# EasyEDA Pro project EasyEDApro.epro, schematic Energy meter
Board Name: Board; Create Date: 2024-08-28; Page Name: P1; Project Name: Robo-EM-ESP32C6-no-uart; Schematic Name: Energy meter; Update Date: 2025-01-08; Company: ROBONOMICS.NETWORK; Drawed: ludovich88; Page Size: A3; Part Number: RNDR-1; Version: RC3
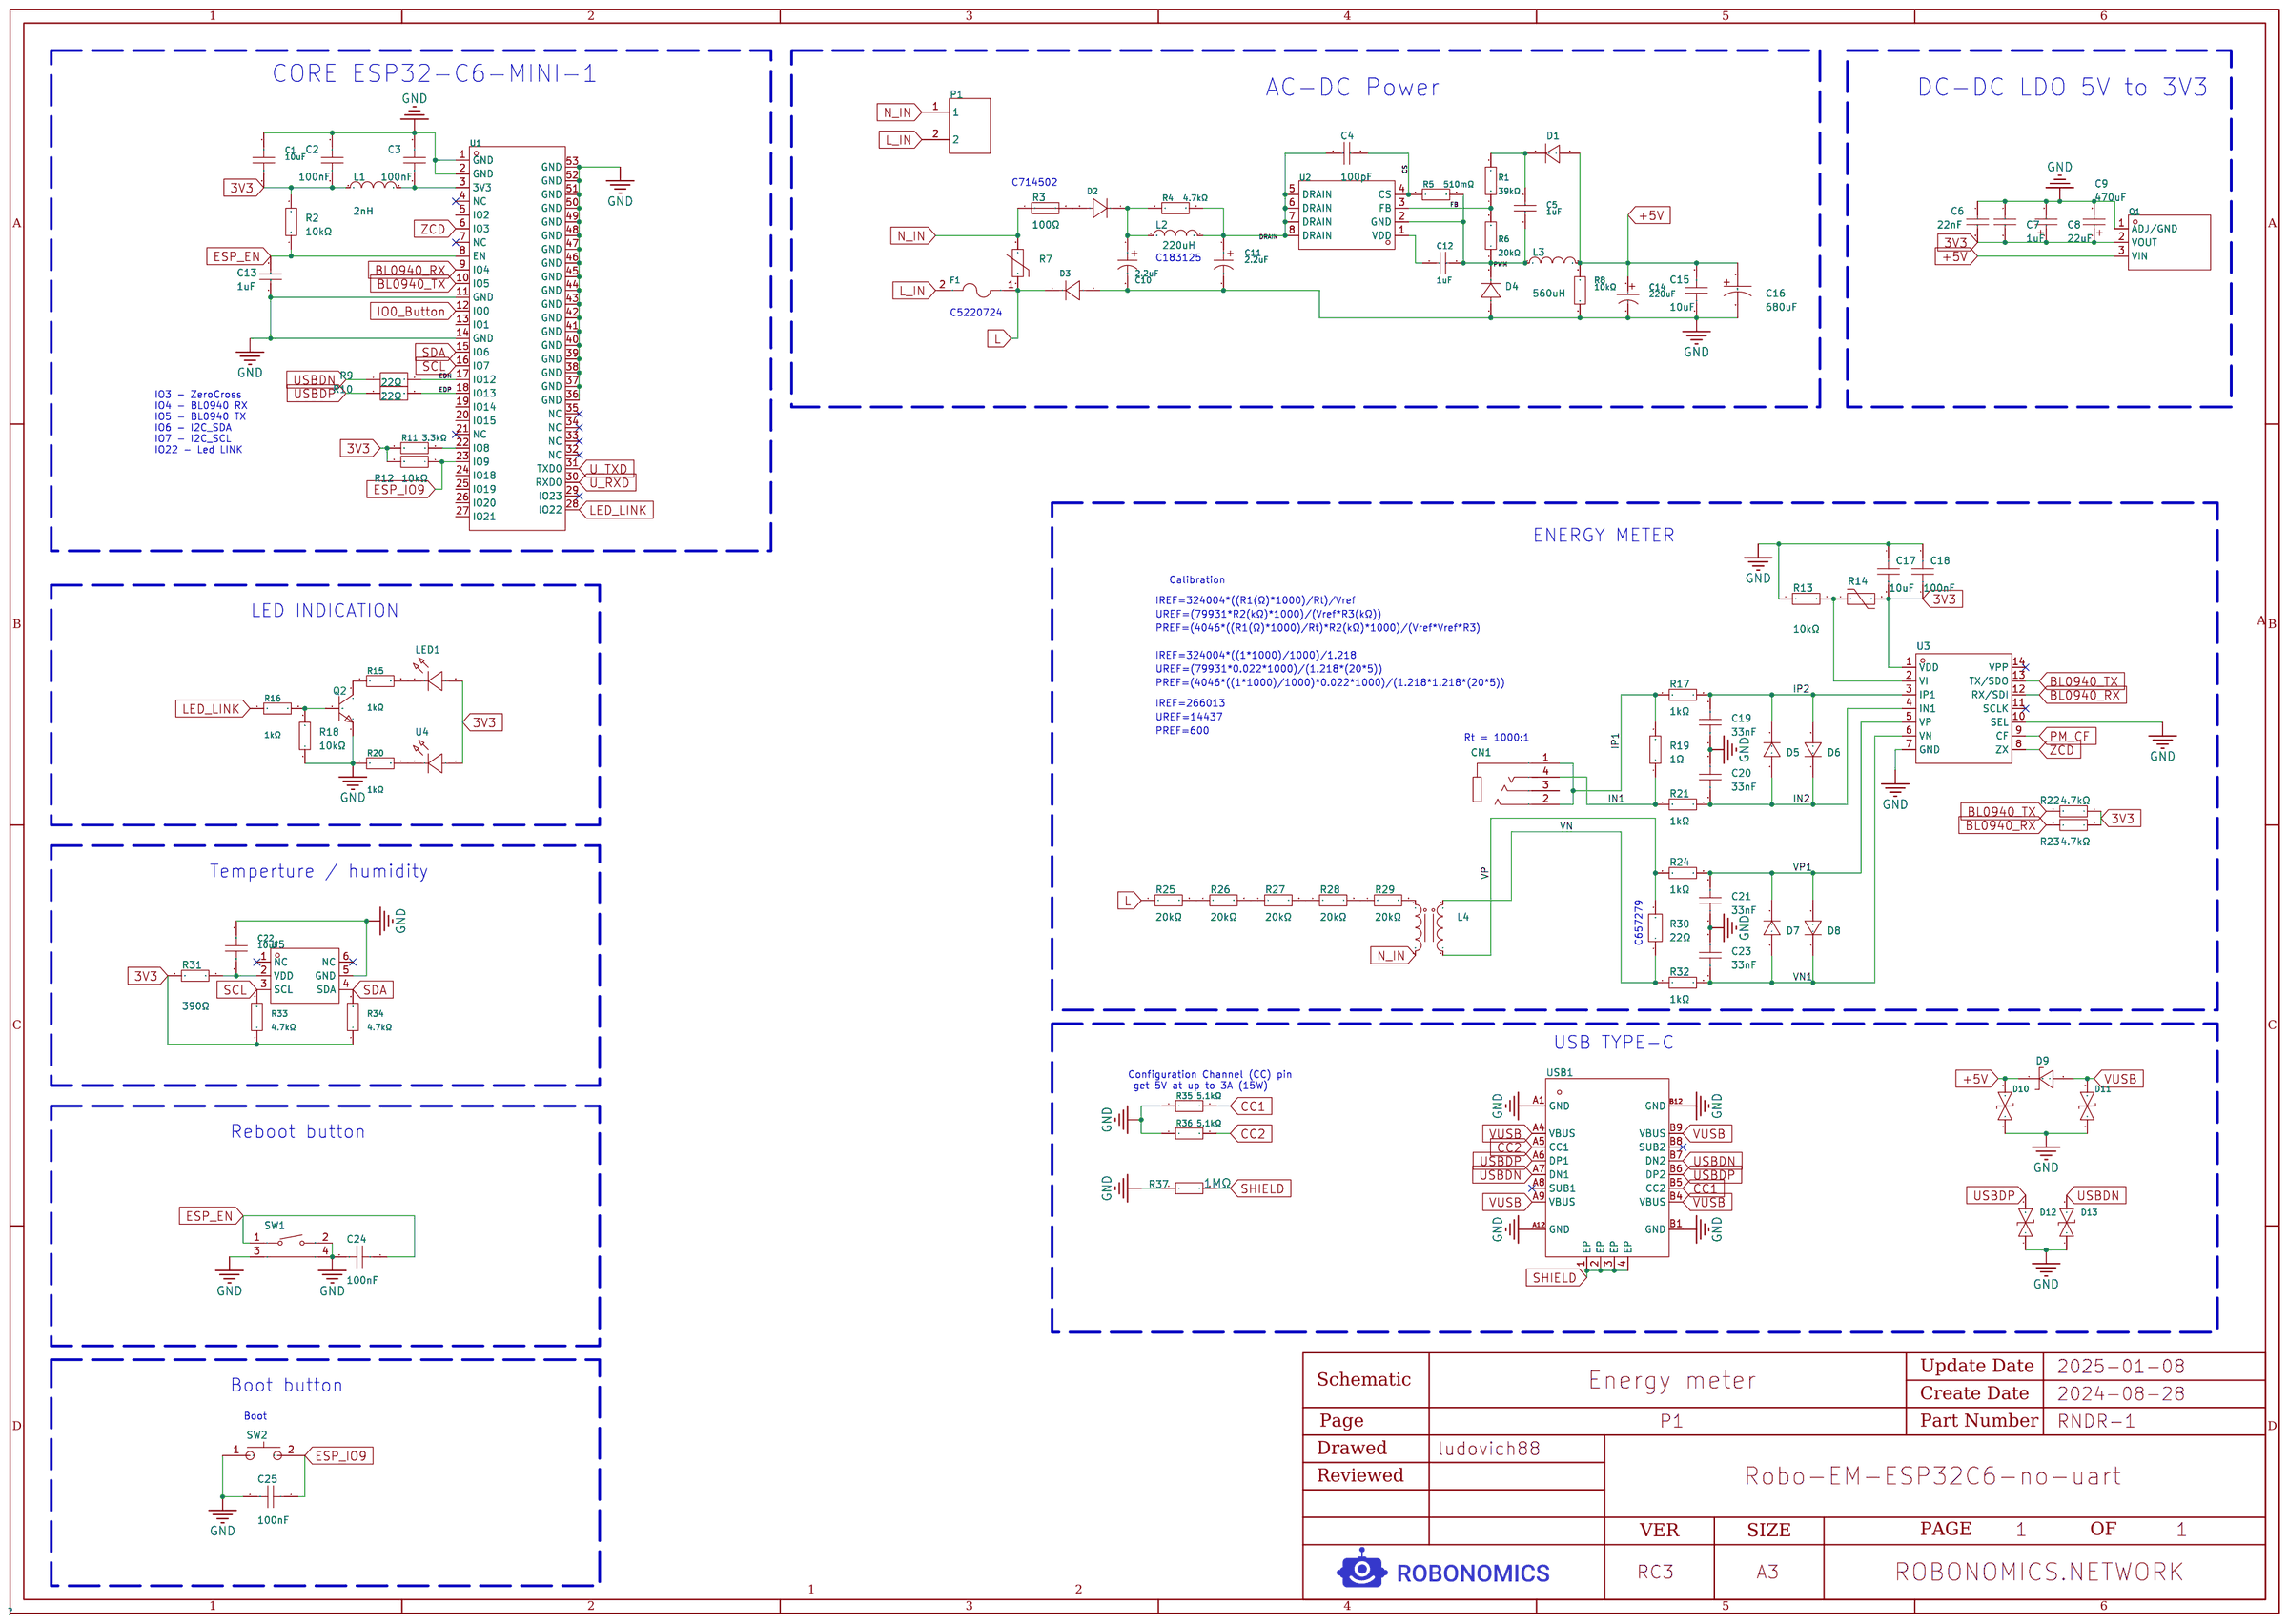
[diagram p0: schematic sheet]

## Parts
C1  10uF  [C0603]
C2  100nF  [C0603]
C3  100nF  [C0603]
C4  100pF  [C1206]
C5  1uF  [C0805]
C6  22nF  [C0603]
C7  1uF  [C0603]
C8  22uF  [CASE-A_3216]
C9  470uF  [CASE-D_7343]  (no BOM)
C10  2.2uF  [CAP-TH_BD6.3-P2.50-D0.5-FD]
C11  2.2uF  [CAP-TH_BD6.3-P2.50-D0.5-FD]
C12  1uF  [C0805]
C13  1uF  [C0603]
C14  220uF  [CAP-TH_BD6.3-P2.50-D1.0-FD]  (no BOM)
C15  10uF  [C0603]
C16  680uF  [CAP-SMD_L7.3-W4.3]
C17  10uF  [C0603]
C18  100nF  [C0603]
C19  33nF  [C0603]
C20  33nF  [C0603]
C21  33nF  [C0603]
C22  10uF  [C0603]
C23  33nF  [C0603]
C24  100nF  [C0603]
C25  100nF  [C0603]
CN1  PJ-320D  [AUDIO-SMD_PJ-320D]
D1  FR107W  [SOD-123F_L2.8-W1.8-LS3.7-RD]
D2  1N4007  [SOD-123FL_L2.8-W1.8-LS3.7-RD]
D3  1N4007  [SOD-123FL_L2.8-W1.8-LS3.7-RD]
D4  E1J  [SOD-123FL_L2.7-W1.8-LS3.7-RD]
D5  1N4148WS  [SOD-323_L1.8-W1.3-LS2.5-RD]
D6  1N4148WS  [SOD-323_L1.8-W1.3-LS2.5-RD]
D7  1N4148WS  [SOD-323_L1.8-W1.3-LS2.5-RD]
D8  1N4148WS  [SOD-323_L1.8-W1.3-LS2.5-RD]
D9  -  [SOD-323_L1.8-W1.3-LS2.5-RD]
D10  LESD5D5.0CT1G-ES  [SOD-523_L1.2-W0.8-LS1.6-BI]
D11  LESD5D5.0CT1G-ES  [SOD-523_L1.2-W0.8-LS1.6-BI]
D12  LESD5D5.0CT1G-ES  [SOD-523_L1.2-W0.8-LS1.6-BI]
D13  LESD5D5.0CT1G-ES  [SOD-523_L1.2-W0.8-LS1.6-BI]
F1  JFC2410-1200FS  [F2410]
L1  2nH  [L0603]
L2  220uH  [IND-TH_BD4.0-P5.00-D0.8]
L3  560uH  [IND-SMD_L10.5-W10.5]
L4  HPT225A-G  [XFMR-TH_4P-L19.0-10.0-P7.20]
LED1  XL-4008UGC  [LED-SMD_L4.0-W1.4-RD_GREEN]
P1  WJ128V-5.0-2P  [CONN-TH_2P-P5.00_WJ128V-5.0-2P]
Q1  AMS1117-3.3V  [SOT-89-3_L4.5-W2.5-P1.50-LS4.2-BR]
Q2  SS8050  [SOT-23-3_L2.9-W1.6-P1.90-LS2.8-BR]
R1  39kΩ  [R0805]
R2  10kΩ  [R0402]
R3  100Ω  [IND-TH_BD4.0-P5.00-D0.8]
R4  4.7kΩ  [R0603]
R5  510mΩ  [R1206]
R6  20kΩ  [R0805]
R7  07D471K68RV0149  [RES-SMD_L8.2-W6.3]
R8  10kΩ  [R0805]
R9  22Ω  [R0402]
R10  22Ω  [R0402]
R11  3.3kΩ  [R0402]
R12  10kΩ  [R0402]
R13  10kΩ  [R0402]
R14  CMFA103J3950HANT  [R0603]
R15  1kΩ  [R0402]
R16  1kΩ  [R0402]
R17  1kΩ  [R0603]
R18  10kΩ  [R0402]
R19  1Ω  [R0603]
R20  1kΩ  [R0402]
R21  1kΩ  [R0603]
R22  4.7kΩ  [R0603]
R23  4.7kΩ  [R0603]
R24  1kΩ  [R0603]
R25  20kΩ  [R0603]
R26  20kΩ  [R0603]
R27  20kΩ  [R0603]
R28  20kΩ  [R0603]
R29  20kΩ  [R0603]
R30  22Ω  [R0603]
R31  390Ω  [R0402]
R32  1kΩ  [R0603]
R33  4.7kΩ  [R0402]
R34  4.7kΩ  [R0402]
R35  5.1kΩ  [R0402]
R36  5.1kΩ  [R0402]
R37  1MΩ  [R0603]
SW1  TS-1010-C-A  [KEY-SMD_TX-1010-X-X]
SW2  -  [SW-SMD_L3.9-W2.9-P4.15-LS5.0]
U1  ESP32-C6-MINI-1-N4  [WIFIM-SMD_61P-L16.6-W13.2-P0.80-ESP32-C6-MINI-1-N4]
U2  KP15051SPA  [SOP-8_L4.9-W3.8-P1.27-LS6.0-BL]
U3  BL0940  [TSSOP-14_L5.0-W4.4-P0.65-LS6.4-BL]
U4  XL-4008SURC  [LED-SMD_L4.0-W1.4-FD_C9900036310]
U5  AHT20  [SENSOR-SMD_L3.0-W3.0-P1.00-BR]
USB1  KH-TYPE-C-16P  [USB-C-SMD_KH-TYPE-C-16P]

## Library data of the parts
C1 C22 = GRM188R61E106KA73D: Capacitance: Tolerance:±10% Tolerance:±10% Voltage Rated: Temperature Coefficient:; LCSC Part Name: 10uF ±10% 25V; Supplier Part: C344022; Manufacturer: muRata(村田); Supplier Footprint: 0603; JLCPCB Part Class: Extended Part; Datasheet: https://atta.szlcsc.com/upload/public/pdf/source/20181211/C344022_BB98D43E7DA95E5A749FBFE073C8A3E0.pdf; Supplier: LCSC; Tolerance: ±10%
C2 C3 = CC0603KRX7R9BB104: Capacitance: Tolerance:±10% Tolerance:±10% Voltage Rated: Temperature Coefficient:; LCSC Part Name: 100nF ±10% 50V; Supplier Part: C14663; Manufacturer: YAGEO(国巨); Supplier Footprint: 0603; JLCPCB Part Class: Basic Part; Datasheet: https://atta.szlcsc.com/upload/public/pdf/source/20180910/C282072_33301C7F631E79921B82A8DAC6BCC5B3.pdf; Supplier: LCSC; Tolerance: ±10%; Voltage Rated: 50V; Temperature Coefficient: Y5V
C4 = 1206CG101J102NT_C9188: Capacitance: Tolerance:±5% Tolerance:±5% Voltage Rated: Temperature Coefficient:; LCSC Part Name: 100pF ±5% 1kV; Supplier Part: C9188; Manufacturer: FH(风华); Manufacturer Part: 1206CG101J102NT; Supplier Footprint: 1206; JLCPCB Part Class: Extended Part; Datasheet: https://atta.szlcsc.com/upload/public/pdf/source/20200305/C486355_26A10D38EF8C2A5C37091D0039909270.pdf; Supplier: LCSC; Tolerance: ±5%
C5 C12 = CL21B105KBFNNNE: Capacitance: Tolerance:±10% Tolerance:±10% Voltage Rated: Temperature Coefficient:; LCSC Part Name: 1uF ±10% 50V; Supplier Part: C28323; Manufacturer: SAMSUNG(三星); Supplier Footprint: 0805; JLCPCB Part Class: Basic Part; Datasheet: https://atta.szlcsc.com/upload/public/pdf/source/20160218/1457707763339.pdf; Supplier: LCSC; Tolerance: ±10%
C6 = CL10B223KB8NNNC: Capacitance:22nF Tolerance:±10% Tolerance:±10% Voltage Rated:50V Temperature Coefficient:X7R; LCSC Part Name: 22nF±10%50V; Supplier Part: C21122; Manufacturer: SAMSUNG(三星); Supplier Footprint: 0603; JLCPCB Part Class: BasicPart; Datasheet: https://atta.szlcsc.com/upload/public/pdf/source/20160103/1457707705232.pdf; Supplier: LCSC; Tolerance: ±10%; Voltage Rated: 50V; Temperature Coefficient: X7R
C7 = CL10A105KB8NNNC: Capacitance:1uF Tolerance:±10% Tolerance:±10% Voltage Rated:50V Temperature Coefficient:X5R; LCSC Part Name: 1uF±10%50V; Supplier Part: C15849; Manufacturer: SAMSUNG(三星); Supplier Footprint: 0603; JLCPCB Part Class: BasicPart; Datasheet: https://atta.szlcsc.com/upload/public/pdf/source/20160103/1457707679084.pdf; Supplier: LCSC; Tolerance: ±10%; Voltage Rated: 50V; Temperature Coefficient: X5R
C8 = TAJA226K010RNJ: Capacitance: Tolerance:±10% Tolerance:±10% Rated Voltage: Equivalent Series Resistance(ESR):3Ω@100kHz Operating Temperature:-55℃~+125℃ Operating Temperature:-55℃~+125℃; LCSC Part Name: 22uF ±10% 10V; Supplier Part: C11366; Manufacturer: Kyocera AVX; JLCPCB Part Class: Extended Part; Datasheet: https://atta.szlcsc.com/upload/public/pdf/source/20160107/1457707744993.pdf; Supplier: LCSC; Tolerance: ±10%; Equivalent Series Resistance(ESR): 3Ω@100kHz; Operating Temperature: -55℃~+125℃
C9 = 6TPE470MAZU: Capacitance: Tolerance:±20% Tolerance:±20% Rated Voltage: Equivalent Series Resistance(ESR):35mΩ@100kHz Operating Temperature:-55℃~+105℃ Operating Temperature:-55℃~+105℃; LCSC Part Name: 470uF ±20% 6.3V; Supplier Part: C79114; Manufacturer: PANASONIC(松下); JLCPCB Part Class: Extended Part; Datasheet: https://atta.szlcsc.com/upload/public/pdf/source/20180301/C178383_15198943937361383951.pdf; Supplier: LCSC; Tolerance: ±20%; Equivalent Series Resistance(ESR): 35mΩ@100kHz; Operating Temperature: -55℃~+105℃
C10 C11 = ECH2GM2R2E09OTZO: Capacitance: Tolerance:±20% Tolerance:±20% Rated Voltage: Ripple Current:- Equivalent Series Resistance(ESR):- Lead Spacing:2.5mm φD:- L:- Lifetime @ Temp:-; LCSC Part Name: 2.2uF ±20% 400V; Supplier Part: C784523; Manufacturer: Yunxing(云星); Supplier Footprint: 插件,D6.3xL9mm; JLCPCB Part Class: Extended Part; Datasheet: https://atta.szlcsc.com/upload/public/pdf/source/20200914/C784406_C58084797B874E7C9A84BE67146A332E.pdf; Supplier: LCSC; Tolerance: ±20%; Lead Spacing: 2.5mm
C13 = CL10A105KO8NNNC: Capacitance: Tolerance:±10% Tolerance:±10% Voltage Rated: Temperature Coefficient:; LCSC Part Name: 1uF ±10% 16V; Supplier Part: C1592; Manufacturer: SAMSUNG(三星); Supplier Footprint: 0603; JLCPCB Part Class: Extended Part; Datasheet: https://atta.szlcsc.com/upload/public/pdf/source/20220919/9FBE606BE0D9532D730F292EB26DC5BB.pdf; Supplier: LCSC; Tolerance: ±10%
C14 = 16YXJ220M6.3X11: Capacitance: Tolerance:±20% Tolerance:±20% Rated Voltage: Ripple Current:400mA@100kHz Equivalent Series Resistance(ESR):220mΩ@100kHz Lead Spacing: φD: L: Lifetime @ Temp:7000hrs@105℃; LCSC Part Name: 220uF ±20% 16V; Supplier Part: C88757; Manufacturer: rubycon(红宝石); Supplier Footprint: 插件,D6.3xL11mm; JLCPCB Part Class: Extended Part; Datasheet: https://atta.szlcsc.com/upload/public/pdf/source/20190927/C432444_D90212164DBC1B856ABE912664018FD4.pdf; Supplier: LCSC; Tolerance: ±20%; Ripple Current: 400mA@100kHz; Equivalent Series Resistance(ESR): 220mΩ@100kHz; Lifetime @ Temp: 7000hrs@105℃
C15 = CL10A106KP8NNNC: Capacitance: Tolerance:±10% Tolerance:±10% Voltage Rated: Temperature Coefficient:; LCSC Part Name: 10uF ±10% 10V; Supplier Part: C19702; Manufacturer: SAMSUNG(三星); Supplier Footprint: 0603; JLCPCB Part Class: Basic Part; Datasheet: https://atta.szlcsc.com/upload/public/pdf/source/20160218/1457707763339.pdf; Supplier: LCSC; Tolerance: ±10%; Voltage Rated: 10V; Temperature Coefficient: X5R
C16 = TAJE687K006RNJ: Capacitance: Tolerance:±10% Tolerance:±10% Rated Voltage: Equivalent Series Resistance(ESR):500mΩ@100kHz Operating Temperature:-55℃~+125℃ Operating Temperature:-55℃~+125℃; LCSC Part Name: 680uF±10%6.3V; Supplier Part: C308811; Manufacturer: KyoceraAVX; Supplier Footprint: CASE-E-7343; JLCPCB Part Class: ExtendedPart; Datasheet: https://atta.szlcsc.com/upload/public/pdf/source/20181031/C308811_5A7B8BD02B1566F52935A1016FD2A024.pdf; Supplier: LCSC; Tolerance: ±10%; Equivalent Series Resistance(ESR): 500mΩ@100kHz; Operating Temperature: -55℃~+125℃
C17 = CL10A106MQ8NNNC: Capacitance: Tolerance:±20% Tolerance:±20% Voltage Rated: Temperature Coefficient:; LCSC Part Name: 10uF±20%6.3V; Supplier Part: C1691; Manufacturer: SAMSUNG(三星); Supplier Footprint: 0603; JLCPCB Part Class: ExtendedPart; Datasheet: https://atta.szlcsc.com/upload/public/pdf/source/20160103/1457707690948.pdf; Supplier: LCSC; Tolerance: ±20%
C18 C24 = 0603ZC104KAT2A: Capacitance: Tolerance:±10% Tolerance:±10% Voltage Rated: Temperature Coefficient:; LCSC Part Name: 100nF±10%10V; Supplier Part: C597251; Manufacturer: KyoceraAVX; Supplier Footprint: 0603; Datasheet: https://atta.szlcsc.com/upload/public/pdf/source/20200611/C596996_5C2870FCBE04273D0B42880C13DA8C38.pdf; Supplier: LCSC; Tolerance: ±10%
C19-C21 C23 = CC0603JRX7R9BB333: Capacitance: Tolerance:±5% Tolerance:±5% Voltage Rated: Temperature Coefficient:; LCSC Part Name: 33nF±5%50V; Supplier Part: C327162; Manufacturer: YAGEO(国巨); Supplier Footprint: 0603; JLCPCB Part Class: ExtendedPart; Datasheet: https://atta.szlcsc.com/upload/public/pdf/source/20181031/C327162_E0FA0E4D62FC939BEC1D516A6479F390.pdf; Supplier: LCSC; Tolerance: ±5%
C25 = CC0603KRX7R9BB104: Capacitance: Tolerance:±10% Tolerance:±10% Voltage Rated: Temperature Coefficient:; LCSC Part Name: 100nF ±10% 50V; Supplier Part: C14663; Manufacturer: YAGEO(国巨); Supplier Footprint: 0603; JLCPCB Part Class: Basic Part; Datasheet: https://atta.szlcsc.com/upload/public/pdf/source/20180910/C282072_33301C7F631E79921B82A8DAC6BCC5B3.pdf; Supplier: LCSC; Tolerance: ±10%
CN1 = PJ-320D_C431535: Connector Type:3.5mm耳机座 Current Rating (Max):300mA Voltage Rating (Max):50V Operating Temperature Range:-16℃~+65℃ Operating Temperature Range:-16℃~+65℃; LCSC Part Name: 3.5mm耳机座; Supplier Part: C431535; Manufacturer: SHOU HAN(首韩); Supplier Footprint: SMD; JLCPCB Part Class: Extended Part; Datasheet: https://atta.szlcsc.com/upload/public/pdf/source/20190925/C431535_8B274506621F6117FB020BF07A197848.pdf; Supplier: LCSC; Connector Type: 3.5mm耳机座; Current Rating (Max): 300mA; Voltage Rating (Max): 50V; Operating Temperature Range: -16℃~+65℃
D1 = FR107W_C122857: Diode Configuration: Forward Voltage (Vf@If):1.3V@1A Reverse Voltage (Vr): Average Rectified Current (Io): Reverse Leakage Current:5uA@1kV Reverse Recovery Time (trr): Operating Temperature:-55℃~+150℃@(Tj) Operating Temperature:-55℃~+150℃@(Tj); LCSC Part Name: 电压:1kV 电流:1A; Supplier Part: C122857; Manufacturer: SHIKUES(时科); Supplier Footprint: SOD-123F; JLCPCB Part Class: Extended Part; Datasheet: https://atta.szlcsc.com/upload/public/pdf/source/20180316/F3E7108A5E6E8028984F3C9596186C34.pdf; Supplier: LCSC; Forward Voltage (Vf@If): 1.3V@1A; Reverse Leakage Current: 5uA@1kV; Operating Temperature: -55℃~+150℃@(Tj)
D2 D3 = 1N4007_C2892681: Diode Configuration: Forward Voltage (Vf@If):1.1V@1A Reverse Voltage (Vr): Average Rectified Current (Io):900mA Reverse Leakage Current:10uA@1kV; LCSC Part Name: 电压:1kV 电流:900mA; Supplier Part: C2892681; Manufacturer: YONGYUTAI(永裕泰); Supplier Footprint: SOD-123FL; JLCPCB Part Class: Extended Part; Datasheet: https://atta.szlcsc.com/upload/public/pdf/source/20210906/CD4B8BA5932635E7169B31B2BD14088A.pdf; Supplier: LCSC; Forward Voltage (Vf@If): 1.1V@1A; Average Rectified Current (Io): 900mA; Reverse Leakage Current: 10uA@1kV
D4 = E1J_C2940141: Diode Configuration: Forward Voltage (Vf@If):1.7V@1A Reverse Voltage (Vr): Average Rectified Current (Io): Reverse Leakage Current:5uA@600V Reverse Recovery Time (trr): Operating Temperature:-55℃~+150℃@(Tj) Operating Temperature:-55℃~+150℃@(Tj); LCSC Part Name: 电压:600V 电流:1A; Supplier Part: C2940141; Manufacturer: LGE(鲁光); Supplier Footprint: SOD-123FL; JLCPCB Part Class: Extended Part; Datasheet: https://atta.szlcsc.com/upload/public/pdf/source/20211231/1226450B3FE7439E66FFBC955F653A9D.pdf; Supplier: LCSC; Forward Voltage (Vf@If): 1.7V@1A; Reverse Leakage Current: 5uA@600V; Operating Temperature: -55℃~+150℃@(Tj)
D5-D8 = 1N4148WS_C2128: Diode Configuration: Power Dissipation: Reverse Voltage (Vr): Average Rectified Current (Io): Forward Voltage (Vf@If):1.25V@150mA Reverse Leakage Current:1uA@75V Reverse Recovery Time (trr): Operating Temperature:+150℃@(Tj) Operating Temperature:+150℃@(Tj; LCSC Part Name: 100V150mA4nsT4; Supplier Part: C2128; Manufacturer: CJ(江苏长电/长晶); Supplier Footprint: SOD-323; JLCPCB Part Class: BasicPart; Datasheet: https://atta.szlcsc.com/upload/public/pdf/source/20140809/1457707208178.pdf; Supplier: LCSC; Forward Voltage (Vf@If): 1.25V@150mA; Reverse Leakage Current: 1uA@75V; Operating Temperature: +150℃@(Tj)
D9 = 1N5819WS: Reverse Voltage (Vr):40V Average Rectified Current (Io):1A Forward Voltage (Vf@If):600mV@1A; LCSC Part Name: 40V1A600mV@1A; Supplier Part: C191023; Manufacturer: Hottech(合科泰); Supplier Footprint: SOD-323; JLCPCB Part Class: BasicPart; Datasheet: https://atta.szlcsc.com/upload/public/pdf/source/20180614/C191023_3C6A6398B911F3A4C23E7538EE054643.pdf; Supplier: LCSC; Reverse Voltage (Vr): 40V; Average Rectified Current (Io): 1A; Forward Voltage (Vf@If): 600mV@1A
D10-D13 = LESD5D5.0CT1G-ES: polarity:Bidirectional Reverse Stand-Off Voltage (Vrwm):5V Maximum Clamping Voltage:10V Peak Pulse Current (Ipp):8A Peak Pulse Power Dissipation (Ppp):80W Breakdown Voltage:5.8V Reverse Leakage Current (Ir):1uA Number of Lines:Single channel Operating Tem; LCSC Part Name: 普容5.0V，单路双向ESD静电防护器件，30kV，CJ：12pF；音频/视频/通讯防护; Supplier Part: C5199159; Manufacturer: ElecSuper(静芯微); Supplier Footprint: SOD523; JLCPCB Part Class: Extended Part; Datasheet: https://atta.szlcsc.com/upload/public/pdf/source/20240905/10776531C4DE5F6ADA679023752259EC.pdf; Supplier: LCSC; polarity: Bidirectional; Reverse Stand-Off Voltage (Vrwm): 5V; Maximum Clamping Voltage: 10V; Peak Pulse Current (Ipp): 8A; Peak Pulse Power Dissipation (Ppp): 80W; Breakdown Voltage: 5.8V; Reverse Leakage Current (Ir): 1uA; Number of Lines: Single channel; Type: ESD
F1 = JFC2410-1200FS: Type:SMD Fuse Current Rating:2A Voltage Rating  (AC):250V Breaking Capacity:50A Operating Temperature:-55℃~+125℃ Operating Temperature:-55℃~+125℃; LCSC Part Name: 250V贴片式保险丝; Supplier Part: C136365; Manufacturer: JDTfuse(集电通); Supplier Footprint: SMD; JLCPCB Part Class: Extended Part; Datasheet: https://atta.szlcsc.com/upload/public/pdf/source/20230515/4DD82964BD259009D7CA201DAB95185E.pdf; Supplier: LCSC; Type: SMD Fuse; Current Rating: 2A; Voltage Rating  (AC): 250V; Breaking Capacity: 50A; Operating Temperature: -55℃~+125℃
L1 = SDCL1608C2N0STDF_C370234: Inductance: Rated Current:- Saturation Current (Isat):- DC Resistance (DCR):- Q @ Freq:- Frequency - Self Resonant:- Ratings:; Supplier Part: C370234; Manufacturer: Sunlord(顺络); Manufacturer Part: SDCL1608C2N0STDF; Supplier Footprint: 0603; JLCPCB Part Class: Extended Part; Datasheet: https://atta.szlcsc.com/upload/public/pdf/source/20231027/6126A3AAC5912C34388756BE22DEE00C.pdf; Supplier: LCSC
L2 = LGA0410-221KP13E: Inductance: Tolerance:±10% Tolerance:±10% Rated Current:155mA Current - Saturation (Isat):- DC Resistance:5.1Ω Type:Color Circle Coils Inductor Q @ Frequency:55@0.796MHz Frequency - Self Resonant:3MHz Ratings:-; LCSC Part Name: 220uH ±10% 色环电感; Supplier Part: C5158890; Manufacturer: FH(风华); Supplier Footprint: 插件,D4xL10.5mm; Datasheet: https://atta.szlcsc.com/upload/public/pdf/source/20230223/1045017E562DFC965C7BA3020EAE4653.pdf; Supplier: LCSC; Tolerance: ±10%; Rated Current: 155mA; DC Resistance: 5.1Ω; Type: Color Circle Coils Inductor; Q @ Frequency: 55@0.796MHz; Frequency - Self Resonant: 3MHz
L3 = SCDS105R-561M-N: Inductance: Tolerance:±20% Tolerance:±20% Rated Current: DC Resistance (DCR): Type:屏蔽电感; LCSC Part Name: 560uH ±20%; Supplier Part: C329732; Manufacturer: chilisin(奇力新); Supplier Footprint: SMD,10.5x10.3mm; JLCPCB Part Class: Extended Part; Datasheet: https://atta.szlcsc.com/upload/public/pdf/source/20190103/C329740_2B9067CB6874BEF2823D8CF3C9943344.pdf; Supplier: LCSC; Tolerance: ±20%; Type: 屏蔽电感
L4 = HPT225A-G: Current Ratio:1:1 Current Rating:2mA Frequency Range:0.02kHz~10kHz Secondary Side Inductance:- DCR Primary Side (Max):115Ω DCR Secondary Side (Max):115Ω High Potential:4000V@AC; Supplier Part: C254112; Manufacturer: HOP(北京霍远); Supplier Footprint: 插件; JLCPCB Part Class: ExtendedPart; Datasheet: https://atta.szlcsc.com/upload/public/pdf/source/20201208/C254112_A7B3C0B9ED08E71DD9E60AC055CA5EE3.pdf; Supplier: LCSC; Current Ratio: 1:1; Current Rating: 2mA; Frequency Range: 0.02kHz~10kHz; DCR Primary Side (Max): 115Ω; DCR Secondary Side (Max): 115Ω; High Potential: 4000V@AC
LED1 = XL-4008UGC: Emitted Color:Emerald Lens Color:Colorless transparence Dominant Wavelength:520nm~525nm Dominant Wavelength:520nm~525nm Peak Wavelength:525nm Forward Current:50mA Power Dissipation:125mW Viewing Angle:120° Mounting Sytle:Side stickers Operating Temperatur; LCSC Part Name: 侧贴; Supplier Part: C2843772; Manufacturer: XINGLIGHT(成兴光); Supplier Footprint: SMD,1.4x4mm; JLCPCB Part Class: ExtendedPart; Datasheet: https://atta.szlcsc.com/upload/public/pdf/source/20221102/5120FC94C7C2123DB0544AD5FB85956A.pdf; Supplier: LCSC; Emitted Color: Emerald; Lens Color: Colorlesstransparence; Dominant Wavelength: 520nm~525nm; Peak Wavelength: 525nm; Forward Current: 50mA; Power Dissipation: 125mW; Viewing Angle: 120°; Mounting Sytle: Sidestickers; Operating Temperature: -30℃~+85℃
P1 = WJ128V-5.0-2P: Pitch:5mm Structure:1x2P Number of Rows:1 Number of PINs Per Row:2 Mounting Style:直针 Current Rating (Max):20A Voltage Rating (Max):250V Wire Gauge - AWG:12~22 Wire Gauge - AWG:12~22 Wire Gauge - mm2:2.5 Wire Gauge - mm2:2.5 Operating Temperature Range:-40; LCSC Part Name: 5mm1x2P排数:1每排P数:2直针可拼接; Supplier Part: C8269; Manufacturer: KANGNEX(康奈克斯电气); Supplier Footprint: 插件,P=5mm; JLCPCB Part Class: ExtendedPart; Datasheet: https://atta.szlcsc.com/upload/public/pdf/source/20191225/C8269_1FF44D6D2E83DB14A7CA266A410FD9AD.pdf; Supplier: LCSC; Pitch: 5mm; Structure: 1x2P; Number of Rows: 1; Number of PINs Per Row: 2; Mounting Style: 直针; Current Rating (Max): 20A; Voltage Rating (Max): 250V; Wire Gauge - AWG: 12~22; Wire Gauge - mm2: 2.5; Operating Temperature Range: -40℃~+105℃; Color: Green
Q1 = AMS1117-3.3V_C5120796: Output Type: Maximum Input Voltage:18V Output Voltage:3.3V Output Voltage:3.3V MAX Output Current:1A Dropout Voltage:1.4V@(1A) standby current:12mA Operating Temperature:0℃~+125℃ Operating Temperature:0℃~+125℃ Output Polarity:Positive electrode Number of; LCSC Part Name: 输入18V 输出3.3V 1A; Supplier Part: C5120796; Manufacturer: MSKSEMI(美森科); Supplier Footprint: SOT-89; JLCPCB Part Class: Extended Part; Datasheet: https://atta.szlcsc.com/upload/public/pdf/source/20231123/6117526697EB8BF6175FDEEBA0877266.pdf; Supplier: LCSC; Maximum Input Voltage: 18V; Output Voltage: 3.3V; MAX Output Current: 1A; Dropout Voltage: 1.4V@(1A); standby current: 12mA; Operating Temperature: 0℃~+125℃; Output Polarity: Positive electrode; Number of Outputs: 1
Q2 = SS8050_C181160: Transistor Type: Collector-Emitter Breakdown Voltage (Vceo): Collector Current (Ic): Power Dissipation (Pd): Collector Cut-Off Current (Icbo):100nA Collector-Emitter Saturation Voltage (VCE(sat)@Ic,Ib):500mV@800mA,80mA DC Current Gain (hFE@Ic,Vce):200@100; LCSC Part Name: NPN25V1.5AH档（200-350）; Supplier Part: C181160; Manufacturer: Hottech(合科泰); Supplier Footprint: SOT-23; JLCPCB Part Class: ExtendedPart; Datasheet: https://atta.szlcsc.com/upload/public/pdf/source/20220506/87BBA77FEE9CB4B19031AE933C67329E.pdf; Supplier: LCSC; Collector Cut-Off Current (Icbo): 100nA; Collector-Emitter Saturation Voltage (VCE(sat)@Ic,Ib): 500mV@800mA,80mA; DC Current Gain (hFE@Ic,Vce): 200@100mA,1V; Transition Frequency (fT): 100MHz; Operating Temperature: +150℃@(Tj)
R1 = 0805W8J0393T5E: Type:Thick Film Resistors Resistance:39kΩ Tolerance:±5% Tolerance:±5% Power(Watts): Overload Voltage (Max): Temperature Coefficient:±100ppm/℃ Temperature Coefficient:±100ppm/℃ Operating Temperature Range:-55℃~+155℃ Operating Temperature Range:-55℃~+155℃; LCSC Part Name: 39kΩ ±5% 125mW 厚膜电阻; Supplier Part: C25632; Manufacturer: UNI-ROYAL(厚声); Supplier Footprint: 0805; JLCPCB Part Class: Extended Part; Datasheet: https://atta.szlcsc.com/upload/public/pdf/source/20200306/C422600_1E6D84923E4A46A82E41ADD87F860B5C.pdf; Supplier: LCSC; Type: Thick Film Resistors; Tolerance: ±5%; Temperature Coefficient: ±100ppm/℃; Operating Temperature Range: -55℃~+155℃
R2 R12 R13 R18 = RC0402FR-0710KL: Type:Thick Film Resistors Resistance: Tolerance:±1% Tolerance:±1% Power(Watts): Overload Voltage (Max): Temperature Coefficient:±100ppm/℃ Temperature Coefficient:±100ppm/℃ Operating Temperature Range:-55℃~+155℃ Operating Temperature Range:-55℃~+155℃; LCSC Part Name: 厚膜电阻 10kΩ ±1% 62.5mW; Supplier Part: C60490; Manufacturer: YAGEO(国巨); Supplier Footprint: 0402; JLCPCB Part Class: Extended Part; Datasheet: https://atta.szlcsc.com/upload/public/pdf/source/20170925/C131467_1506321478108990263.pdf; Supplier: LCSC; Type: Thick Film Resistors; Tolerance: ±1%; Temperature Coefficient: ±100ppm/℃; Operating Temperature Range: -55℃~+155℃
R3 = RFS01J1000A520NH: Type:Safety Resistor Resistance: Tolerance:±5% Tolerance:±5% Overload Voltage (Max):350V Power(Watts):1W Temperature Coefficient:±350ppm/℃ Temperature Coefficient:±350ppm/℃; LCSC Part Name: 保险电阻 100Ω ±5% 1W; Supplier Part: C274980; Manufacturer: 双羽; Supplier Footprint: 插件; JLCPCB Part Class: Extended Part; Datasheet: https://atta.szlcsc.com/upload/public/pdf/source/20181008/C275112_61B57CF4FECD9E771366D1DDFC695024.pdf; Supplier: LCSC; Type: Safety Resistor; Tolerance: ±5%; Overload Voltage (Max): 350V; Power(Watts): 1W; Temperature Coefficient: ±350ppm/℃
R4 R22 R23 = 0603WAF4701T5E: Type:Thick Film Resistors Resistance:4.7kΩ Tolerance:±1% Tolerance:±1% Power(Watts): Overload Voltage (Max): Temperature Coefficient:±100ppm/℃ Temperature Coefficient:±100ppm/℃ Operating Temperature Range:-55℃~+155℃ Operating Temperature Range:-55℃~+155℃; LCSC Part Name: 4.7kΩ ±1% 100mW 厚膜电阻; Supplier Part: C23162; Manufacturer: UNI-ROYAL(厚声); Supplier Footprint: 0603; JLCPCB Part Class: Basic Part; Datasheet: https://atta.szlcsc.com/upload/public/pdf/source/20200306/C422600_1E6D84923E4A46A82E41ADD87F860B5C.pdf; Supplier: LCSC; Type: Thick Film Resistors; Tolerance: ±1%; Temperature Coefficient: ±100ppm/℃; Operating Temperature Range: -55℃~+155℃
R5 = RTT06R510FTP: Type:Thick Film Resistors Resistance: Tolerance:±1% Tolerance:±1% Power(Watts): Overload Voltage (Max): Temperature Coefficient:±200ppm/℃ Temperature Coefficient:±200ppm/℃ Operating Temperature Range:-55℃~+155℃ Operating Temperature Range:-55℃~+155℃; LCSC Part Name: 厚膜电阻 510mΩ ±1% 333.333mW; Supplier Part: C104948; Manufacturer: RALEC(旺诠); Supplier Footprint: 1206; JLCPCB Part Class: Extended Part; Datasheet: https://atta.szlcsc.com/upload/public/pdf/source/20191219/C158410_884373A5B7E1BC76BF57BC45A946C093.pdf; Supplier: LCSC; Type: Thick Film Resistors; Tolerance: ±1%; Temperature Coefficient: ±200ppm/℃; Operating Temperature Range: -55℃~+155℃
R6 = RTT052002FTP: Type:Thick Film Resistors Resistance: Tolerance:±1% Tolerance:±1% Power(Watts): Overload Voltage (Max): Temperature Coefficient:±100ppm/℃ Temperature Coefficient:±100ppm/℃ Operating Temperature Range:-55℃~+155℃ Operating Temperature Range:-55℃~+155℃; LCSC Part Name: 厚膜电阻 20kΩ ±1% 125mW; Supplier Part: C104081; Manufacturer: RALEC(旺诠); Supplier Footprint: 0805; JLCPCB Part Class: Extended Part; Datasheet: https://atta.szlcsc.com/upload/public/pdf/source/20191219/C158410_884373A5B7E1BC76BF57BC45A946C093.pdf; Supplier: LCSC; Type: Thick Film Resistors; Tolerance: ±1%; Temperature Coefficient: ±100ppm/℃; Operating Temperature Range: -55℃~+155℃
R7 = 07D471K68RV0149: Varistor Voltage:470V Varistor Voltage:470V Clamping Voltage: Allowable Voltage (DC): Allowable Voltage (AC): Peak Current: Maximum Energy:20J Maximum Energy:20J Typical Capatitance:140pF@1kHz Rated Wattage:250mW; LCSC Part Name: 钳位电压775V 20焦耳 贴片压敏电阻; Supplier Part: C2836432; Manufacturer: KNSCHA(科尼盛); Supplier Footprint: SMD,3225; JLCPCB Part Class: Extended Part; Datasheet: https://atta.szlcsc.com/upload/public/pdf/source/20220505/AA8F3A0EE096C907DE4148B38AA17D85.pdf; Supplier: LCSC; Varistor Voltage: 470V; Maximum Energy: 20J; Typical Capatitance: 140pF@1kHz; Rated Wattage: 250mW
R8 = 0805W8F1002T5E: Type:Thick Film Resistors Resistance:10kΩ Tolerance:±1% Tolerance:±1% Power(Watts): Overload Voltage (Max): Temperature Coefficient:±100ppm/℃ Temperature Coefficient:±100ppm/℃ Operating Temperature Range:-55℃~+155℃ Operating Temperature Range:-55℃~+155℃; LCSC Part Name: 10kΩ ±1% 125mW 厚膜电阻; Supplier Part: C17414; Manufacturer: UNI-ROYAL(厚声); Supplier Footprint: 0805; JLCPCB Part Class: Basic Part; Datasheet: https://atta.szlcsc.com/upload/public/pdf/source/20200306/C422600_1E6D84923E4A46A82E41ADD87F860B5C.pdf; Supplier: LCSC; Type: Thick Film Resistors; Tolerance: ±1%; Temperature Coefficient: ±100ppm/℃; Operating Temperature Range: -55℃~+155℃
R9 R10 = AF0402JR-0722RL: Type:Thick Film Resistors Resistance: Tolerance:±5% Tolerance:±5% Power(Watts): Overload Voltage (Max): Temperature Coefficient:±100ppm/℃ Temperature Coefficient:±100ppm/℃ Operating Temperature Range:-55℃~+155℃ Operating Temperature Range:-55℃~+155℃; LCSC Part Name: 厚膜电阻 22Ω ±5% 62.5mW; Supplier Part: C2096536; Manufacturer: YAGEO(国巨); Supplier Footprint: 0402; JLCPCB Part Class: Extended Part; Datasheet: https://atta.szlcsc.com/upload/public/pdf/source/20210711/C2096536_5BFAA065630A335B57D8426C33F2F1C9.pdf; Supplier: LCSC; Type: Thick Film Resistors; Tolerance: ±5%; Temperature Coefficient: ±100ppm/℃; Operating Temperature Range: -55℃~+155℃
R11 = 0402WGF3301TCE: Type:Thick Film Resistors Resistance:3.3kΩ Tolerance:±1% Tolerance:±1% Power(Watts): Overload Voltage (Max): Temperature Coefficient:±100ppm/℃ Temperature Coefficient:±100ppm/℃ Operating Temperature Range:-55℃~+155℃ Operating Temperature Range:-55℃~+155℃; LCSC Part Name: 3.3kΩ ±1% 62.5mW 厚膜电阻; Supplier Part: C25890; Manufacturer: UNI-ROYAL(厚声); Supplier Footprint: 0402; JLCPCB Part Class: Basic Part; Datasheet: https://atta.szlcsc.com/upload/public/pdf/source/20200306/C422600_1E6D84923E4A46A82E41ADD87F860B5C.pdf; Supplier: LCSC; Type: Thick Film Resistors; Tolerance: ±1%; Temperature Coefficient: ±100ppm/℃; Operating Temperature Range: -55℃~+155℃
R14 = CMFA103J3950HANT: Resistance @ 25℃: B Constant (25℃/50℃): Resistance Tolerance: B Constant (25℃/75℃):- B Constant (25℃/85℃):- B Constant (25℃/100℃):- Power:- B Constant Tolerance: Steady State Current (Max):- Operating Temperature:-40℃~+120℃ Operating Temperature:-40℃~+120; LCSC Part Name: 10kΩ 电阻精度:±5% 3950K; Supplier Part: C338606; Manufacturer: FH(风华); Supplier Footprint: 0603; JLCPCB Part Class: Extended Part; Datasheet: https://atta.szlcsc.com/upload/public/pdf/source/20220119/3414CF77FD36D08131816493DD49E1F1.pdf; Supplier: LCSC; Operating Temperature: -40℃~+120℃
R15 R16 R20 = 0402WGF1001TCE: Type:Thick Film Resistors Resistance:1kΩ Tolerance:±1% Tolerance:±1% Power(Watts): Overload Voltage (Max): Temperature Coefficient:±100ppm/℃ Temperature Coefficient:±100ppm/℃ Operating Temperature Range:-55℃~+155℃ Operating Temperature Range:-55℃~+155℃; LCSC Part Name: 1kΩ ±1% 62.5mW 厚膜电阻; Supplier Part: C11702; Manufacturer: UNI-ROYAL(厚声); Supplier Footprint: 0402; Datasheet: https://atta.szlcsc.com/upload/public/pdf/source/20200306/C422600_1E6D84923E4A46A82E41ADD87F860B5C.pdf; Supplier: LCSC; Type: Thick Film Resistors; Tolerance: ±1%; Temperature Coefficient: ±100ppm/℃; Operating Temperature Range: -55℃~+155℃
R17 R21 R24 R32 = RT0603BRD071KL: Type:Thin Film Resistor Resistance: Tolerance:±0.1% Tolerance:±0.1% Power(Watts): Temperature Coefficient:±25ppm/℃ Temperature Coefficient:±25ppm/℃ Overload Voltage (Max): Operating Temperature Range:-55℃~+155℃ Operating Temperature Range:-55℃~+155℃; LCSC Part Name: 1kΩ ±0.1% 100mW; Supplier Part: C110776; Manufacturer: YAGEO(国巨); Supplier Footprint: 0603; JLCPCB Part Class: Extended Part; Datasheet: https://atta.szlcsc.com/upload/public/pdf/source/20170704/1499151282044.pdf; Supplier: LCSC; Type: Thin Film Resistor; Tolerance: ±0.1%; Temperature Coefficient: ±25ppm/℃; Operating Temperature Range: -55℃~+155℃
R19 = 0603WAF100KT5E: Type:Thick Film Resistors Resistance: Tolerance:±1% Tolerance:±1% Power(Watts): Temperature Coefficient:±400ppm/℃ Temperature Coefficient:±400ppm/℃ Overload Voltage (Max): Operating Temperature Range:-55℃~+155℃ Operating Temperature Range:-55℃~+155℃; LCSC Part Name: 1Ω±1%100mW; Supplier Part: C22936; Manufacturer: UNI-ROYAL(厚声); Supplier Footprint: 0603; JLCPCB Part Class: BasicPart; Datasheet: https://atta.szlcsc.com/upload/public/pdf/source/20200306/C422600_1E6D84923E4A46A82E41ADD87F860B5C.pdf; Supplier: LCSC; Type: ThickFilmResistors; Tolerance: ±1%; Temperature Coefficient: ±400ppm/℃; Operating Temperature Range: -55℃~+155℃
R25-R29 = RMC060320K5%N: Resistance: Tolerance:±5% Tolerance:±5% Power(Watts):; LCSC Part Name: 20kΩ±5%100mW; Supplier Part: C269687; Manufacturer: Tyohm(幸亚电阻); Supplier Footprint: 0603; JLCPCB Part Class: ExtendedPart; Datasheet: https://atta.szlcsc.com/upload/public/pdf/source/20190115/C269687_69A4A0E4D1D819843C4DF5B029A253CB.pdf; Supplier: LCSC; Tolerance: ±5%
R30 = TD03G22R0BT: Temperature Coefficient: Temperature Coefficient: Tolerance: Power(Watts): Resistance: Overload Voltage (Max): Operating Temperature Range: Operating Temperature Range:; LCSC Part Name: 22Ω(22R0)±0.1%1/10W; Supplier Part: C2984310; Manufacturer: FH(风华); Supplier Footprint: 0603; JLCPCB Part Class: ExtendedPart; Datasheet: https://atta.szlcsc.com/upload/public/pdf/source/20200616/C657321_2CFA27FA726BC0D0F6223AF922169515.pdf; Supplier: LCSC
R31 = AC0402FR-07390RL: Type:Thick Film Resistors Resistance: Tolerance:±1% Tolerance:±1% Power(Watts): Overload Voltage (Max): Temperature Coefficient:±100ppm/℃ Temperature Coefficient:±100ppm/℃ Operating Temperature Range:-55℃~+155℃ Operating Temperature Range:-55℃~+155℃; LCSC Part Name: 厚膜电阻 390Ω ±1% 62.5mW; Supplier Part: C227027; Manufacturer: YAGEO(国巨); Supplier Footprint: 0402; JLCPCB Part Class: Extended Part; Datasheet: https://atta.szlcsc.com/upload/public/pdf/source/20180927/C229861_4ABDC471507C1ED6AFB4BA66AFC8620A.pdf; Supplier: LCSC; Type: Thick Film Resistors; Tolerance: ±1%; Temperature Coefficient: ±100ppm/℃; Operating Temperature Range: -55℃~+155℃
R33 R34 = 0402WGF4701TCE: Type:Thick Film Resistors Resistance:4.7kΩ Tolerance:±1% Tolerance:±1% Power(Watts): Overload Voltage (Max): Temperature Coefficient:±100ppm/℃ Temperature Coefficient:±100ppm/℃ Operating Temperature Range:-55℃~+155℃ Operating Temperature Range:-55℃~+155℃; LCSC Part Name: 4.7kΩ ±1% 62.5mW 厚膜电阻; Supplier Part: C25900; Manufacturer: UNI-ROYAL(厚声); Supplier Footprint: 0402; Datasheet: https://atta.szlcsc.com/upload/public/pdf/source/20200306/C422600_1E6D84923E4A46A82E41ADD87F860B5C.pdf; Supplier: LCSC; Type: Thick Film Resistors; Tolerance: ±1%; Temperature Coefficient: ±100ppm/℃; Operating Temperature Range: -55℃~+155℃
R35 R36 = 0402WGF5101TCE: Type:Thick Film Resistors Resistance:5.1kΩ Tolerance:±1% Tolerance:±1% Power(Watts): Overload Voltage (Max): Temperature Coefficient:±100ppm/℃ Temperature Coefficient:±100ppm/℃ Operating Temperature Range:-55℃~+155℃ Operating Temperature Range:-55℃~+155℃; LCSC Part Name: 5.1kΩ ±1% 62.5mW 厚膜电阻; Supplier Part: C25905; Manufacturer: UNI-ROYAL(厚声); Supplier Footprint: 0402; Datasheet: https://atta.szlcsc.com/upload/public/pdf/source/20200306/C422600_1E6D84923E4A46A82E41ADD87F860B5C.pdf; Supplier: LCSC; Type: Thick Film Resistors; Tolerance: ±1%; Temperature Coefficient: ±100ppm/℃; Operating Temperature Range: -55℃~+155℃
R37 = 0603WAF1004T5E: LCSC Part Name: 1MΩ(1004)±1%编带; Supplier Part: C22935; Manufacturer: UNI-ROYAL(厚声); Supplier Footprint: 0603; JLCPCB Part Class: BasicPart; Datasheet: https://atta.szlcsc.com/upload/public/pdf/source/20170920/C22935_1505900992858982324.pdf; Supplier: LCSC
SW1 = TS-1010-C-A: Contact Current:50mA Voltage Rating (DC):12V Insulation Resistance:- Circuit:SPST Mounting Style:Surface Mount Actuator Style:Rectangle button Actuator/Cap Color:Black With Lamp:No Operating Force:260gf Mechanical Life:100000次 Operating Temperature:-30℃~+; LCSC Part Name: 卧贴2*4*3.5mm轻触开关; Supplier Part: C692458; Manufacturer: XKBConnectivity(中国星坤); Supplier Footprint: SMD; JLCPCB Part Class: ExtendedPart; Datasheet: https://atta.szlcsc.com/upload/public/pdf/source/20211011/09621D275CE0F472C941775DFBBCCC96.pdf; Supplier: LCSC; Contact Current: 50mA; Voltage Rating (DC): 12V; Circuit: SPST; Mounting Style: SurfaceMount; Actuator Style: Rectanglebutton; Actuator/Cap Color: Black; With Lamp: No; Operating Force: 260gf; Mechanical Life: 100000次; Operating Temperature: -30℃~+85℃; Switch Length: 2mm; Switch Width: 4mm; Switch Height: 3.5mm; Strike Gundam: NO
SW2 = GT-TC029B-H020-L1N: Contact Current:50mA Voltage Rating (DC):12V Insulation Resistance:100MΩ Circuit:SPST Mounting Style:Brick nogging Actuator Style:Round Button Actuator/Cap Color:Black With Lamp:No Operating Force:250gf@±30gf Mechanical Life:100000 Operating Temperature:-; LCSC Part Name: 立式两脚小龟H2.0250gf无柱; Supplier Part: C843665; Manufacturer: G-Switch(品赞); Supplier Footprint: SMD; Datasheet: https://atta.szlcsc.com/upload/public/pdf/source/20201014/C843665_B07D254A2E90B746498E934B945CCD5F.pdf; Supplier: LCSC; Contact Current: 50mA; Voltage Rating (DC): 12V; Insulation Resistance: 100MΩ; Circuit: SPST; Mounting Style: Bricknogging; Actuator Style: RoundButton; Actuator/Cap Color: Black; With Lamp: No; Operating Force: 250gf@±30gf; Mechanical Life: 100000; Operating Temperature: -30℃~+85℃; Pin Style: SMDSplicing; Switch Length: 3.9mm; Switch Width: 2.9mm; Switch Height: 2mm; Strike Gundam: NO
U1 = ESP32-C6-MINI-1-N4: Supplier Part: C5736265; Manufacturer: ESPRESSIF(乐鑫); Supplier Footprint: SMD-53P; JLCPCB Part Class: Extended Part; Datasheet: https://atta.szlcsc.com/upload/public/pdf/source/20240130/4529D418EFEC832950EB8101798FAED6.pdf; Supplier: LCSC
U2 = KP15051SPA: Supplier Part: C2692462; Manufacturer: Kiwi Instruments(必易微); Supplier Footprint: SOP-8; JLCPCB Part Class: Extended Part; Datasheet: https://atta.szlcsc.com/upload/public/pdf/source/20211008/C2692463_6C6B089654C8A2FFF7D4732E77013046.pdf; Supplier: LCSC
U3 = BL0940: LCSC Part Name: 电能计量芯片; Supplier Part: C691894; Manufacturer: BL(上海贝岭); Supplier Footprint: TSSOP-14; JLCPCB Part Class: ExtendedPart; Datasheet: https://atta.szlcsc.com/upload/public/pdf/source/20200628/C691894_DF23B4F5A06D0F64D9A7C5BC935783C1.pdf; Supplier: LCSC
U4 = XL-4008SURC: Emitted Color:红灯 Lens Color:Colorless transparence Dominant Wavelength:620nm~625nm Dominant Wavelength:620nm~625nm Peak Wavelength:625nm Forward Current:50mA Power Dissipation:125mW Viewing Angle:120° Mounting Sytle:Side stickers Operating Temperature:-30; LCSC Part Name: 红灯侧贴; Supplier Part: C2843771; Manufacturer: XINGLIGHT(成兴光); Supplier Footprint: SMD,1.4x4mm; JLCPCB Part Class: ExtendedPart; Datasheet: https://atta.szlcsc.com/upload/public/pdf/source/20221102/EAC0B38F8924C881A99BE374D0B10640.pdf; Supplier: LCSC; Emitted Color: 红灯; Lens Color: Colorlesstransparence; Dominant Wavelength: 620nm~625nm; Peak Wavelength: 625nm; Forward Current: 50mA; Power Dissipation: 125mW; Viewing Angle: 120°; Mounting Sytle: Sidestickers; Operating Temperature: -30℃~+85℃
U5 = AHT20: Supplier Part: C2757850; Manufacturer: 广州奥松; Supplier Footprint: SMD; Datasheet: https://atta.szlcsc.com/upload/public/pdf/source/20231023/00557B34ED120268320A4810FF8DED4D.pdf; Supplier: LCSC
USB1 = KH-TYPE-C-16P: Connector Type:Type-C Standard:- Gender:Female Number of Contacts:16 Number of Ports:1 Mounting Style:Surface Mount Current Rating - Power (Max):3A Operating Temperature Range:-40℃~+85℃ Operating Temperature Range:-40℃~+85℃; LCSC Part Name: Type-C母座卧贴; Supplier Part: C709357; Manufacturer: kinghelm(金航标); Supplier Footprint: SMD; Datasheet: https://atta.szlcsc.com/upload/public/pdf/source/20200911/C709357_AA8DCEB38BB20E3035A7ED7AE7667837.pdf; Supplier: LCSC; Connector Type: Type-C; Gender: Female; Number of Contacts: 16; Number of Ports: 1; Mounting Style: SurfaceMount; Current Rating - Power (Max): 3A; Operating Temperature Range: -40℃~+85℃

## Nets
3V3: C1.2 C2.2 C6.2 C7.2 C8.1 C9.1 C17.2 C18.1 L1.1 LED1.2(A) Q1.2(VOUT) R2.2 R11.1 R12.2 R14.2 R22.1 R23.1 R31.1 R33.1 R34.1 U3.1(VDD) U4.1(A)
+5V: C14.1 C15.2 C16.1 D1.2(A) D9.1(C) D10.2 L3.2 Q1.3(VIN) R8.2
GND: C1.1 C2.1 C3.1 C6.1 C7.1 C8.2 C9.2 C10.2 C11.2 C13.2 C14.2 C15.1 C16.2 C17.1 C18.2 C19.1 C20.2 C21.1 C22.2 C23.2 C24.2 C25.2 D3.2(A) D4.2(A) D10.1 D11.1 D12.1 D13.1 Q1.1(ADJ/GND) Q2.2(E) R8.1 R13.1 R18.1 R20.1 R35.1 R36.1 R37.1 SW1.2 SW1.3 SW1.4 SW2.1 U1.1(GND) U1.2(GND) U1.11(GND) U1.14(GND) U1.36(GND) U1.37(GND) U1.38(GND) U1.39(GND) U1.40(GND) U1.41(GND) U1.42(GND) U1.43(GND) U1.44(GND) U1.45(GND) U1.46(GND) U1.47(GND) U1.48(GND) U1.49(GND) U1.50(GND) U1.51(GND) U1.52(GND) U1.53(GND) U3.7(GND) U3.10(SEL) U5.5(GND) USB1.A1(GND) USB1.A12(GND) USB1.B1(GND) USB1.B12(GND)
BL0940_RX: R23.2 U1.9(IO4) U3.12(RX/SDI)
BL0940_TX: R22.2 U1.10(IO5) U3.13(TX/SDO)
CC1: R35.2 USB1.B5(CC2)
CC2: R36.2 USB1.A5(CC1)
CS: C4.1 R5.1 U2.4(CS)
DRAIN: C4.2 C11.1 L2.2 R4.2 U2.5(DRAIN) U2.6(DRAIN) U2.7(DRAIN) U2.8(DRAIN)
EDN: R9.2 U1.17(IO12)
EDP: R10.2 U1.18(IO13)
ESP_EN: C13.1 C24.1 R2.1 SW1.1 U1.8(EN)
ESP_IO9: C25.1 R12.1 SW2.2 U1.23(IO9)
FB: R1.1 R6.2 U2.3(FB)
IN1: CN1.4 R19.1 R21.1
IN2: C20.1 D5.2(A) D6.1(K) R21.2 U3.4(IN1)
IO0_Button: U1.12(IO0)
IP1: CN1.1 CN1.2 R17.1 R19.2
IP2: C19.2 D5.1(K) D6.2(A) R17.2 U3.3(IP1)
L: D3.1(K) F1.1 R7.1 R25.1
L_IN: F1.2 P1.2
LED_LINK: R16.1 U1.28(IO22)
N_IN: L4.2 P1.1 R3.1 R7.2
PM_CF: U3.9(CF)
PWM: C5.1 C12.1 D4.1(K) L3.1 R5.2 R6.1 U2.2(GND)
SCL: R33.2 U1.16(IO7) U5.3(SCL)
SDA: R34.2 U1.15(IO6) U5.4(SDA)
SHIELD: R37.2 USB1.1(EP) USB1.2(EP) USB1.3(EP) USB1.4(EP)
U_RXD: U1.30(RXD0)
U_TXD: U1.31(TXD0)
USBDN: D13.2 R9.1 USB1.A7(DN1) USB1.B7(DN2)
USBDP: D12.2 R10.1 USB1.A6(DP1) USB1.B6(DP2)
VN: L4.3 R30.1 R32.1
VN1: C23.1 D7.2(A) D8.1(K) R32.2 U3.6(VN)
VP: L4.4 R24.1 R30.2
VP1: C21.2 D7.1(K) D8.2(A) R24.2 U3.5(VP)
VUSB: D9.2(A) D11.2 USB1.A4(VBUS) USB1.A9(VBUS) USB1.B4(VBUS) USB1.B9(VBUS)
ZCD: U1.6(IO3) U3.8(ZX)
$1N2408: R13.2 R14.1 U3.2(VI)
$1N6046: Q2.1(B) R16.2 R18.2
$1N10199: R28.2 R29.1
$1N10201: R27.2 R28.1
$1N10203: R26.2 R27.1
$1N10205: R25.2 R26.1
$1N34811: L4.1 R29.2
$1N85397: R11.2 U1.22(IO8)
$1N85419: C3.2 L1.2 U1.3(3V3)
$1N86448: C5.2 D1.1(K) R1.2
$1N86450: C12.2 U2.1(VDD)
$1N94058: C22.1 R31.2 U5.2(VDD)
$1N94503: D2.2(A) R3.2
$1N94519: C10.1 D2.1(K) L2.1 R4.1
$1N99608: R20.2 U4.2(K)
$1N99610: Q2.3(C) R15.1
$1N99612: LED1.1(K) R15.2

Not connected (* = marked no-connect by the designer): CN1 3; U1 4(NC)* 5(IO2) 7(NC)* 13(IO1) 19(IO14) 20(IO15) 21(NC)* 24(IO18) 25(IO19) 26(IO20) 27(IO21) 29(IO23)* 32(NC)* 33(NC)* 34(NC)* 35(NC)*; U3 11(SCLK)* 14(VPP)*; U5 1(NC)* 6(NC)*; USB1 A8(SUB1)* B8(SUB2)*

## Notes on the sheet
- CORE ESP32-C6-MINI-1
- AC-DC Power
- DC-DC LDO 5V to 3V3
- C714502
- C183125
- C5220724
- IO3 - ZeroCross
  IO4 - BL0940 RX
  IO5 - BL0940 TX
  IO6 - I2C_SDA
  IO7 - I2C_SCL
  IO22 - Led LINK
- ENERGY METER
- Calibration
- IREF=324004*((R1(Ω)*1000)/Rt)/Vref
- LED INDICATION
- UREF=(79931*R2(kΩ)*1000)/(Vref*R3(kΩ))
- PREF=(4046*((R1(Ω)*1000)/Rt)*R2(kΩ)*1000)/(Vref*Vref*R3)
- IREF=324004*((1*1000)/1000)/1.218
- UREF=(79931*0.022*1000)/(1.218*(20*5))
- PREF=(4046*((1*1000)/1000)*0.022*1000)/(1.218*1.218*(20*5))
- IREF=266013
- UREF=14437
- PREF=600
- Rt = 1000:1
- Temperture / humidity
- C657279
- USB TYPE-C
- Configuration Channel (CC) pin
   get 5V at up to 3A (15W)
- Reboot button
- Boot button
- Boot
